# EAGLE design BreakOut-8x8-rev2 (EAGLE 7.1.0)
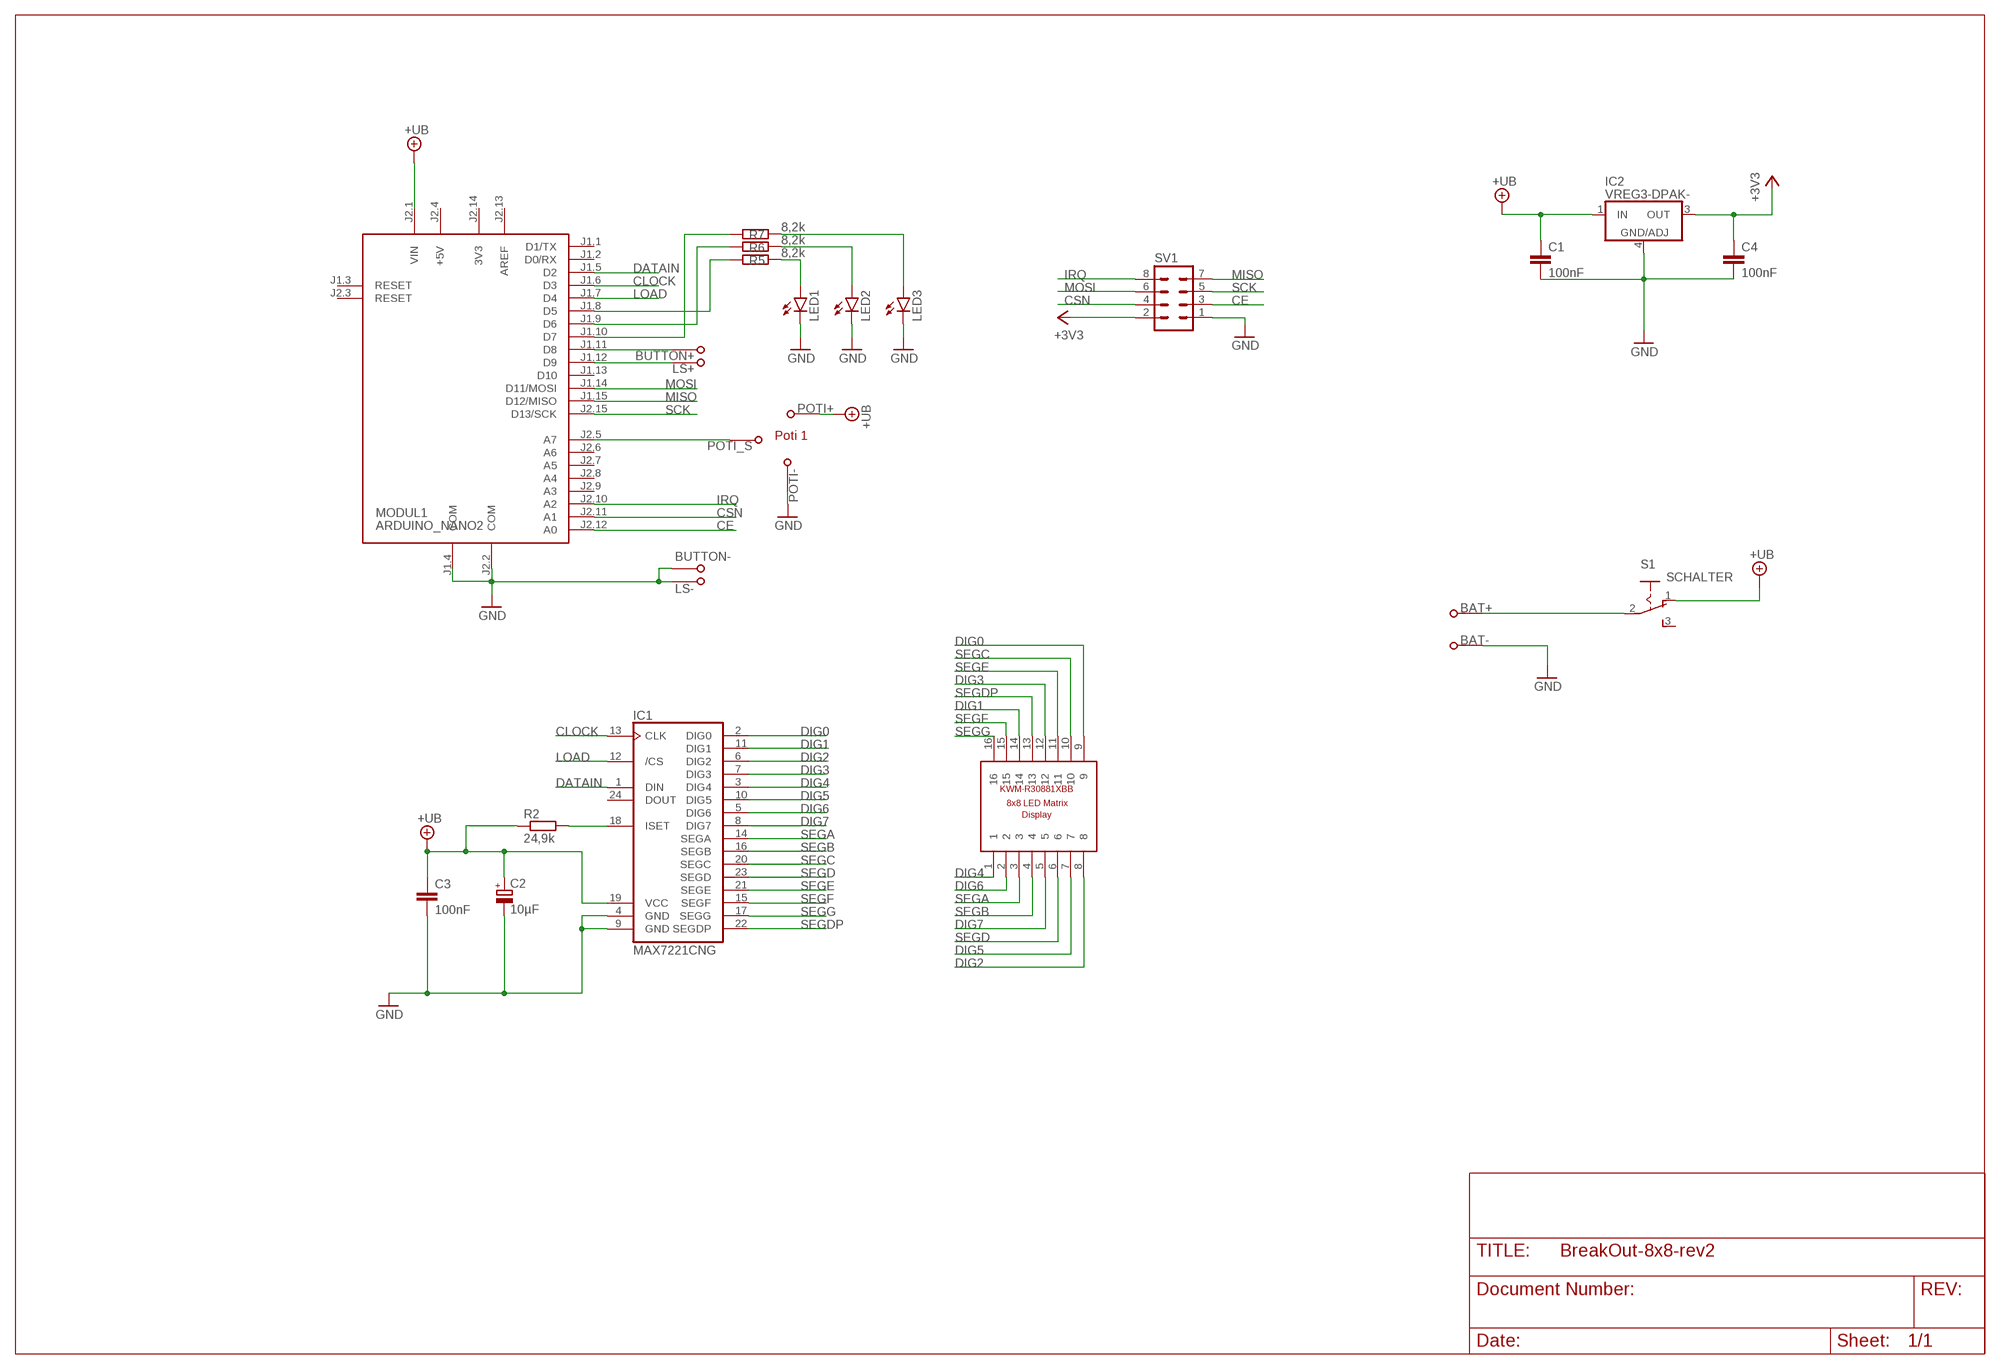
[diagram p0: schematic, sheet 1]

## Parts
BAT+  PAD-NVSMD-2X3  [PAD-SO-2X3]
BAT-  PAD-NVSMD-2X3  [PAD-SO-2X3]
BUTTON+  PAD-NVSMD-2X3  [PAD-SO-2X3]
BUTTON-  PAD-NVSMD-2X3  [PAD-SO-2X3]
C1  100nF  C-EUC0805  [C0805]
C2  10µF  CPOL-EUC/6032-28R  [C/6032-28R]
C3  100nF  C-EUC0805  [C0805]
C4  100nF  C-EUC0805  [C0805]
IC1  MAX7221CNG  [DIL24-3]
IC2  VREG3-DPAK-  [DPAK]
LED1  LED5MM  [LED5MM]
LED2  LED5MM  [LED5MM]
LED3  LED5MM  [LED5MM]
LS+  PAD-NVSMD-2X3  [PAD-SO-2X3]
LS-  PAD-NVSMD-2X3  [PAD-SO-2X3]
MODUL1  ARDUINO_NANO2  [ARDUINO_NANO2]
POTI+  PAD-NVSMD-2X3  [PAD-SO-2X3]
POTI-  PAD-NVSMD-2X3  [PAD-SO-2X3]
POTI_S  PAD-NVSMD-2X3  [PAD-SO-2X3]
R2  24,9k  R-EU_R0805  [R0805]
R5  8,2k  R-EU_R0805  [R0805]
R6  8,2k  R-EU_R0805  [R0805]
R7  8,2k  R-EU_R0805  [R0805]
S1  SCHALTER  [255SB]
SV1  MA04-2  [MA04-2]
U$1  KWM-R30881XBB  [KWM-R30881XBB]

## Nets
+3V3: C4.1 IC2.3(OUT) SV1.2
+UB: C1.1 C2.+ C3.1 IC1.19(VCC) IC2.1(IN) MODUL1.J2.1(VIN) POTI+.1 R2.1 S1.1
BUTTON: MODUL1.J1.10(D7) R7.1
CE: MODUL1.J2.12(A0) SV1.3
CLOCK: IC1.13(CLK) MODUL1.J1.6(D3)
CSN: MODUL1.J2.11(A1) SV1.4
DATAIN: IC1.1(DIN) MODUL1.J1.5(D2)
DIG0: IC1.2(DIG0) U$1.9
DIG1: IC1.11(DIG1) U$1.14
DIG2: IC1.6(DIG2) U$1.8
DIG3: IC1.7(DIG3) U$1.12
DIG4: IC1.3(DIG4) U$1.1
DIG5: IC1.10(DIG5) U$1.7
DIG6: IC1.5(DIG6) U$1.2
DIG7: IC1.8(DIG7) U$1.5
GND: BAT-.1 BUTTON-.1 C1.2 C2.- C3.2 C4.2 IC1.4(GND) IC1.9(GND) IC2.4(GND/ADJ) LED1.K(C) LED2.K(C) LED3.K(C) LS-.1 MODUL1.J1.4(COM) MODUL1.J2.2(COM) POTI-.1 SV1.1
IRQ: MODUL1.J2.10(A2) SV1.8
LOAD: IC1.12(/CS) MODUL1.J1.7(D4)
MISO: MODUL1.J1.15(D12/MISO) SV1.7
MOSI: MODUL1.J1.14(D11/MOSI) SV1.6
N$1: BUTTON+.1 MODUL1.J1.11(D8)
N$2: LED1.A R5.2
N$3: LED2.A R6.2
N$4: LED3.A R7.2
N$5: MODUL1.J2.5(A7) POTI_S.1
N$6: BAT+.1 S1.2
N$17: LS+.1 MODUL1.J1.12(D9)
N$18: IC1.18(ISET) R2.2
N$22: MODUL1.J1.9(D6) R6.1
N$23: MODUL1.J1.8(D5) R5.1
SCK: MODUL1.J2.15(D13/SCK) SV1.5
SEGA: IC1.14(SEGA) U$1.3
SEGB: IC1.16(SEGB) U$1.4
SEGC: IC1.20(SEGC) U$1.10
SEGD: IC1.23(SEGD) U$1.6
SEGDP: IC1.22(SEGDP) U$1.13
SEGE: IC1.21(SEGE) U$1.11
SEGF: IC1.15(SEGF) U$1.15
SEGG: IC1.17(SEGG) U$1.16
Unconnected: IC1.24(DOUT) MODUL1.J1.1(D1/TX) MODUL1.J1.2(D0/RX) MODUL1.J1.3(RESET) MODUL1.J1.13(D10) MODUL1.J2.3(RESET) MODUL1.J2.6(A6) MODUL1.J2.7(A5) MODUL1.J2.8(A4) MODUL1.J2.9(A3) S1.3

## Notes on the sheet
- Poti 1

## Power pins joined to a net without a drawn wire
3V3: MODUL1.J2.14(3V3)
+5V: MODUL1.J2.4(+5V)
AREF: MODUL1.J2.13(AREF)

## Library data of the parts
BAT+ BAT- BUTTON+ BUTTON- LS+ LS- POTI+ POTI- POTI_S = fi-CON:PAD-NV: PAD einzelnes Pad, z.B. zum Anlöten von Kabeln oder als Reserve-Anschluß angelegt: mind. 18.11.2008 / UT letzte Änderung: 17.08.2010 / UT Änderungen 18.11.2008: - PACs hinzugefügt: 04 / 04A / SMD-1X2 / SMD-2X3 - Variante "SMD-1X2" umbenannt in "SMD-1X2Z" wg. geändertem PAC-Namen und neu definiertem 1x2mm-Pad - Prefix geändert in "J" Änderungen 17.08.2010: - PACs hinzugefügt: 13
C1 C3 C4 = rcl:C-EU: CAPACITOR, European symbol
C2 = rcl:CPOL-EU: POLARIZED CAPACITOR, European symbol
IC1 = maxim-5:MAX7221*: Serially Interfaced, 8-Digit LED Display Drivers
IC2 = sy2002:VREG3-?-*
LED1-LED3 = SparkFun-LED:LED: LEDs Standard schematic elements and footprints for 5mm, 3mm, 1206, and 0603 sized LEDs. 5mm - Spark Fun Electronics SKU : COM-00529 (and others)
MODUL1 = arduino:ARDUINO_NANO2: Arduino Nano2 Auto generated by modulcreator.ulp \;; ANZAHL: 2; MODUL: TRUE; STECKX0: -76200; STECKX1: 76200; STECKY0: 177800; STECKY1: 177800
R2 R5-R7 = rcl:R-EU_: RESISTOR, European symbol
S1 = sy2002:SCHALTER
SV1 = con-lstb:MA04-2: PIN HEADER; OC_FARNELL: unknown; OC_NEWARK: unknown
U$1 = sy2002:KWM-R30881XBB: 8x8 LED Matrix Display KWM-R30881ABB KWM-R30881CBB

## Board
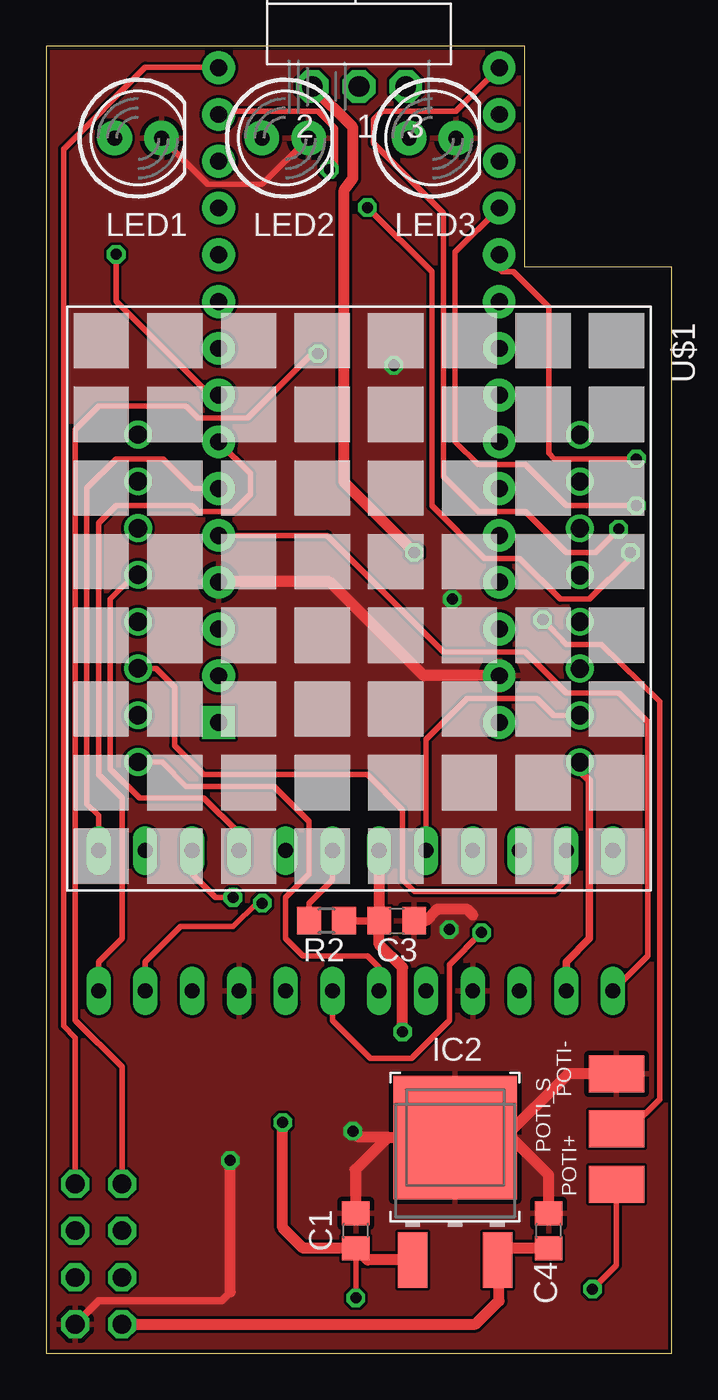
[diagram p1: board, top side]
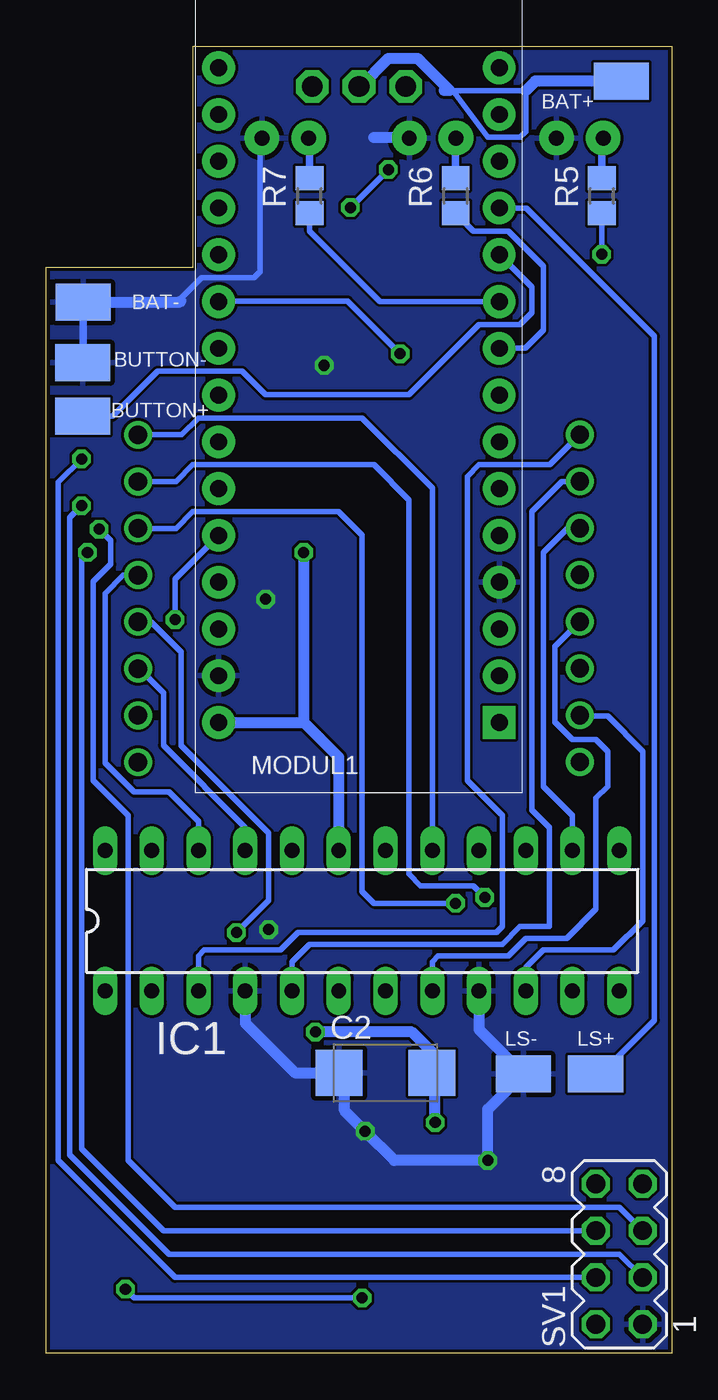
[diagram p2: board, bottom side, seen from below]

Size 34 x 71 mm. Coordinates in mm from the lower left corner, seen from the top.
Outline: 0,0 34,0 34,59 26,59 26,71 0,71 0,0
Copper layers (1*16): Top 0.035mm / dielectric 1.5mm / Bottom 0.035mm
Design rules "default *": minimum track width 10mil, minimum drill 12mil, track to track 6mil, track to pad 6mil, pad to pad 6mil, via to via 6mil, smd to smd 6mil, copper to edge 8mil, drill to drill 8mil, minimum pad ring 10mil, minimum via ring 8mil, stop-mask expansion 4mil, vias tented up to drill 0mil, thermal gap 10mil

### Footprints (pad centres in the part's own frame; a part is rotated, then mirrored left to right if it is on the bottom)
PAD-SO-2X3 = smd 3 x 2: 1 0,0
C0805 = smd 1.3 x 1.5: 1 -0.95,0; 2 0.95,0
C/6032-28R = smd 2.55 x 2.5: + 2.525,0; - -2.525,0
DIL24-3 = drill 0.813 long: 1 -13.97,-3.81; 2 -11.43,-3.81; 3 -8.89,-3.81; 4 -6.35,-3.81; 5 -3.81,-3.81; 6 -1.27,-3.81; 7 1.27,-3.81; 8 3.81,-3.81; 9 6.35,-3.81; 10 8.89,-3.81; 11 11.43,-3.81; 12 13.97,-3.81; 13 13.97,3.81; 14 11.43,3.81; 15 8.89,3.81; 16 6.35,3.81; 17 3.81,3.81; 18 1.27,3.81; 19 -1.27,3.81; 20 -3.81,3.81; 21 -6.35,3.81; 22 -8.89,3.81; 23 -11.43,3.81; 24 -13.97,3.81
DPAK = smd 1.6 x 3: 1 -2.3,0; 3 2.3,0 | smd 6.7 x 6.7: 4 0,6.65
LED5MM = drill 0.813 pad 1.88: A -1.27,0; K 1.27,0
ARDUINO_NANO2 = drill 0.914 pad 1.778 square: J1.1 -7.62,17.78 | drill 0.914 pad 1.778: J1.2 -7.62,15.24; J1.3 -7.62,12.7; J1.4 -7.62,10.16; J1.5 -7.62,7.62; J1.6 -7.62,5.08; J1.7 -7.62,2.54; J1.8 -7.62,0; J1.9 -7.62,-2.54; J1.10 -7.62,-5.08; J1.11 -7.62,-7.62; J1.12 -7.62,-10.16; J1.13 -7.62,-12.7; J1.14 -7.62,-15.24; J1.15 -7.62,-17.78; J2.1 7.62,17.78; J2.2 7.62,15.24; J2.3 7.62,12.7; J2.4 7.62,10.16; J2.5 7.62,7.62; J2.6 7.62,5.08; J2.7 7.62,2.54; J2.8 7.62,0; J2.9 7.62,-2.54; J2.10 7.62,-5.08; J2.11 7.62,-7.62; J2.12 7.62,-10.16; J2.13 7.62,-12.7; J2.14 7.62,-15.24; J2.15 7.62,-17.78
R0805 = smd 1.3 x 1.5: 1 -0.95,0; 2 0.95,0
255SB = drill 1.118 pad 1.778 octagon: 1 -2.54,0; 2 0,0; 3 2.54,0
MA04-2 = drill 1.016 octagon: 1 -3.81,-1.27; 2 -3.81,1.27; 3 -1.27,-1.27; 4 -1.27,1.27; 5 1.27,-1.27; 6 1.27,1.27; 7 3.81,-1.27; 8 3.81,1.27
KWM-R30881XBB = drill 1: 1 -8.9,-12; 2 -6.36,-12; 3 -3.82,-12; 4 -1.28,-12; 5 1.26,-12; 6 3.8,-12; 7 6.34,-12; 8 8.88,-12; 9 8.89,12; 10 6.35,12; 11 3.81,12; 12 1.27,12; 13 -1.27,12; 14 -3.81,12; 15 -6.35,12; 16 -8.89,12

### Placement (x,y rotation side)
BAT+  2.75,69.09 0 bottom
BAT-  31.98,57.09 0 bottom
BUTTON+  32.01,50.9 0 bottom
BUTTON-  32.01,53.81 0 bottom
C1  16.83,6.67 90 top
C2  15.56,15.24 0 bottom
C3  19.05,23.5 0 top
C4  27.3,6.67 90 top
IC1  16.83,23.5 0 bottom
IC2  22.23,5.08 0 top
LED1  5,66 0 top
LED2  13,66 0 top
LED3  21,66 0 top
LS+  4.15,15.19 0 bottom
LS-  8.07,15.19 0 bottom
MODUL1  17,52.05 180 bottom
POTI+  30.99,9.19 0 top
POTI-  30.99,15.19 0 top
POTI_S  30.99,12.19 0 top
R2  15.24,23.5 180 top
R5  3.81,62.87 90 bottom
R6  11.75,62.87 90 bottom
R7  19.68,62.87 90 bottom
S1  17,68.8 0 top
SV1  2.86,5.4 90 bottom
U$1  17,41 270 top

### Tracks (layer width: path | path; a pad name or v marks a point on that pad's centre or on a via)
+3V3
  Top 0.61: SV1.2 23.34,1.59 24.61,2.86 24.61,5 IC2.3 25.16,5.72 C4.1
+UB  (via drill 0.6)
  Top 0.305: POTI+.1 30.99,4.8 v29.69,3.49 | v16.83,3.02 C1.1
  Top 0.406: R2.1 C3.1
  Top 0.61: IC1.19 C3.1 18.1,22.23 19.37,20.95 v19.37,17.46 | IC2.1 17.46,5.08 C1.1 13.97,5.72 12.86,6.83 v12.86,12.54 | v20,43.5 16.19,47.31 16.19,63.18 16.67,63.82 16.67,66.59 S1.1
  Bottom 0.305: v29.69,3.49 29.21,3.02 v16.83,3.02
  Bottom 0.61: MODUL1.J2.1 19.98,34.27 | 19.98,34.27 18.1,32.38 IC1.19 | v19.37,17.46 14.13,17.46 13.03,16.37 C2.+ 12.86,15.07 v12.86,12.54 | 19.98,34.27 19.98,43.47 v20,43.5
BUTTON
  Bottom 0.305: MODUL1.J1.10 15.85,57.12 19.68,60.96 R7.1
CE  (via drill 0.6)
  Top 0.305: v32.07,46.04 28.26,46.04 26.04,48.26 23.5,48.26 22.23,49.53 22.23,59.81 MODUL1.J2.12
  Bottom 0.305: SV1.3 2.86,5.4 27.3,5.4 32.7,10.79 32.7,45.4 v32.07,46.04
CLOCK
  Top 0.305: MODUL1.J1.6 7.96,46.97 6.35,48.58 3.81,48.58 2.22,46.99 2.22,29.84 2.86,29.21 IC1.13
CSN  (via drill 0.6)
  Top 0.305: v32.07,48.58 27.62,48.58 27.3,48.9 27.3,56.83 25.4,58.74 24.77,58.74 24.45,59.05 24.45,59.49 MODUL1.J2.11
  Bottom 0.305: SV1.4 26.99,4.13 33.34,10.48 33.34,47.31 v32.07,48.58
DATAIN
  Top 0.305: MODUL1.J1.5 15.27,44.42 21.59,38.1 26.04,38.1 28.26,35.88 31.11,35.88 32.7,34.29 32.7,21.59 IC1.1
DIG0
  Top 0.406: U$1.9 29,31.64 29.53,31.11 29.53,22.54 28.26,21.27 IC1.2
DIG1  (via drill 0.6)
  Top 0.305: v11.75,24.45 11.43,24.45 10.16,23.18 7.3,23.18 5.4,21.27 IC1.11
  Bottom 0.305: U$1.14 26.95,44.81 26.04,45.72 18.1,45.72 16.83,44.45 16.83,25.08 16.19,24.45 v11.75,24.45
DIG2
  Top 0.305: U$1.8 6.3,32.12 7.62,30.8 12.38,30.8 14.29,28.89 14.29,26.04 13.02,24.77 13.02,22.54 13.97,21.59 17.46,21.59 18.1,20.95 IC1.6
DIG3  (via drill 0.6)
  Top 0.305: v23.65,22.86 21.91,21.11 21.91,18.1 19.84,16.03 17.62,16.03 15.56,18.1 IC1.7
  Bottom 0.305: U$1.12 28.3,39.73 26.67,38.1 26.67,33.02 21.91,28.26 21.91,24.61 v23.65,22.86
DIG4
  Bottom 0.305: IC1.3 25.72,21.59 25.4,21.91 21.27,21.91 20.32,22.86 9.53,22.86 9.21,23.18 9.21,29.21 11.11,31.11 11.11,47.62 10.48,48.26 6.64,48.26 U$1.1
DIG5
  Bottom 0.305: IC1.10 7.94,20.95 6.99,21.91 3.17,21.91 1.59,23.5 1.59,32.7 3.49,34.61 4.95,34.61 U$1.7
DIG6
  Bottom 0.305: U$1.2 5.98,47.36 7.62,45.72 7.62,29.53 6.67,28.57 6.67,23.18 8.26,23.18 9.21,22.23 19.68,22.23 20.64,21.27 IC1.5
DIG7
  Bottom 0.305: IC1.8 13.02,21.27 12.7,21.59 8.89,21.59 7.94,22.54 5.71,22.54 4.13,24.13 4.13,30.16 3.49,30.8 3.49,32.7 4.13,33.34 5.4,33.34 6.35,34.29 6.35,38.39 U$1.5
GND  (via drill 0.6)
  Top 0.305: LED2.K 14.25,66 11.75,63.5 8.77,63.5 LED1.K
  Top 0.406: SV1.1 2.86,2.86 9.53,2.86 10,3.33 | 16.67,10 16.83,9.84
  Top 0.61: C3.2 20.64,23.5 21.27,24.13 22.86,24.13 23.18,23.81 | MODUL1.J2.2 20.5,36.8 15.4,41.91 9.4,41.91 MODUL1.J1.4 | C4.2 27.3,9.68 25.4,11.59 24.77,11.59 | 24.77,11.59 22.37,11.59 IC2.4 22.21,11.75 18.57,11.75 | POTI-.1 28.37,15.19 24.77,11.59 | C1.2 16.83,9.84 16.83,10 18.57,11.75 | 18.57,11.75 16.99,11.75 v16.67,12.06 | 10,3.33 v10,10.48
  Bottom 0.305: 26.67,57.15 26.67,57.31 25.56,58.42 22.7,58.42 22.38,58.74 22.38,65.89 LED3.K
  Bottom 0.406: BAT-.1 31.98,53.84 BUTTON-.1
  Bottom 0.61: LED3.K 22.27,66.15 | 16.19,66.04 14.31,66.04 LED2.K | BAT-.1 26.73,57.09 26.67,57.15 | IC1.4 23.18,17.94 20.48,15.24 C2.- 17.78,14.94 17.78,13.18 v16.67,12.06 15.08,10.48 v10,10.48 10,13.26 LS-.1 10.48,17.6 IC1.9
  other vias: 18.89,53.66 22.07,40.96 21.91,23.02
  pour Bottom: 0,0 33.81,0 33.81,70.8 0,70.8
  pour Top: 0,0 33.97,0 33.97,70.96 0,70.96
IRQ  (via drill 0.6)
  Top 0.305: SV1.8 4.13,15.56 1.59,18.1 1.59,50.16 2.86,51.44 7.62,51.44 8.26,50.8 10.95,50.8 14.45,54.29 v14.76,54.29
  Bottom 0.305: v14.76,54.29 17.62,57.15 24.59,57.15 MODUL1.J2.10
LOAD
  Top 0.305: IC1.12 2.86,21.27 4.13,22.54 4.13,30.16 2.86,31.43 2.86,45.09 3.81,46.04 7.94,46.04 8.26,45.72 10.16,45.72 11.11,46.67 11.11,47.77 MODUL1.J1.7
MISO
  Top 0.305: SV1.7 1.59,17.14 0.95,17.78 0.95,65.41 5.4,69.85 9.36,69.85 MODUL1.J1.15
MOSI  (via drill 0.6)
  Top 0.305: v31.75,43.5 31.75,43.18 29.53,40.96 27.94,40.96 25.72,43.18 23.81,43.18 20.95,46.04 20.95,58.74 v17.46,62.23 | MODUL1.J1.14 9.88,67.47 14.76,67.47 15.72,66.52 15.72,64.61 v15.4,64.29
  Bottom 0.305: SV1.6 27.62,6.67 32.07,11.11 32.07,43.18 v31.75,43.5 | v17.46,62.23 v15.4,64.29
N$1
  Bottom 0.305: BUTTON+.1 30.39,50.9 27.94,53.34 23.34,53.34 22.07,52.07 14.29,52.07 10.48,55.88 8.26,55.88 7.62,56.52 7.62,57.91 MODUL1.J1.11
N$2
  Bottom 0.406: R5.2 3.81,65.92 LED1.A
N$3
  Bottom 0.406: R6.2 11.75,65.98 LED2.A
N$4
  Bottom 0.406: R7.2 19.68,65.95 LED3.A
N$5  (via drill 0.6)
  Top 0.305: POTI_S.1 31.72,12.19 33.34,13.81 33.34,35.4 30.16,38.5 28.26,38.5 v26.99,39.85
  Bottom 0.305: v26.99,39.85 26.99,42.06 MODUL1.J2.5
N$6
  Bottom 0.305: 11.91,68.58 7.94,68.58 7.94,66.36 8.26,66.04 10,66.04 11.91,68.58 | 11.91,68.58 12.06,68.58
  Bottom 0.61: BAT+.1 7.42,69.09 7.94,68.58 | 12.38,68.58 12.06,68.58 13.81,70.33 15.4,70.33 16.93,68.8 S1.2
N$17
  Bottom 0.305: LS+.1 3.86,15.19 0.95,18.1 0.95,55.24 7.91,62.2 MODUL1.J1.12
N$18
  Top 0.305: IC1.18 15.56,25.72 14.29,24.45 R2.2
N$22
  Bottom 0.305: MODUL1.J1.9 7.96,54.59 6.99,55.56 6.99,59.05 8.89,60.96 10.79,60.96 R6.1
N$23  (via drill 0.6)
  Top 0.305: MODUL1.J1.8 8.91,52.05 3.81,57.15 v3.81,59.69
  Bottom 0.305: v3.81,59.69 R5.1
SCK  (via drill 0.6)
  Top 0.305: v31.11,44.77 29.84,43.5 28.26,43.5 26.04,45.72 23.5,45.72 21.59,47.62 21.59,61.91 17.78,65.72 17.78,66.99 18.26,67.47 22.26,67.47 MODUL1.J2.15
  Bottom 0.305: SV1.5 2.86,7.94 26.99,7.94 29.53,10.48 29.53,29.21 31.43,31.11 31.43,41.91 30.48,42.86 30.48,44.13 v31.11,44.77
SEGA
  Bottom 0.305: U$1.3 5.66,44.82 6.99,43.5 6.99,30.8 5.4,29.21 IC1.14
SEGB
  Top 0.305: U$1.4 4.82,42.28 3.49,40.96 3.49,31.75 5.08,30.16 8.57,30.16 10.48,28.26 IC1.16
SEGC
  Top 0.305: U$1.10 27.58,34.65 26.67,35.56 22.86,35.56 20.64,33.34 IC1.20
SEGD
  Top 0.305: U$1.6 5.98,37.2 6.99,36.2 6.99,33.02 8.57,31.43 17.46,31.43 19.37,29.53 19.37,25.72 20,25.08 27.62,25.08 28.26,25.72 IC1.23
SEGDP
  Bottom 0.305: U$1.13 29.8,42.27 30.8,41.27 30.8,32.07 29.21,30.48 27.3,30.48 25.72,28.89 IC1.22
SEGE
  Bottom 0.305: U$1.11 28.93,37.19 27.62,35.88 27.62,33.02 23.18,28.57 IC1.21
SEGF  (via drill 0.6)
  Top 0.305: v10.16,24.77 9.21,24.77 7.94,26.04 IC1.15
  Bottom 0.305: U$1.15 26.95,47.35 26.04,48.26 16.19,48.26 14.29,46.35 14.29,26.04 13.65,25.4 10.79,25.4 v10.16,24.77
SEGG
  Bottom 0.305: U$1.16 26.63,49.89 25.72,50.8 16.83,50.8 13.02,46.99 IC1.17